# Altium schematic sheet NANO_HEADER.SchDoc
size A; SheetNumber: 10; SheetTotal: 14
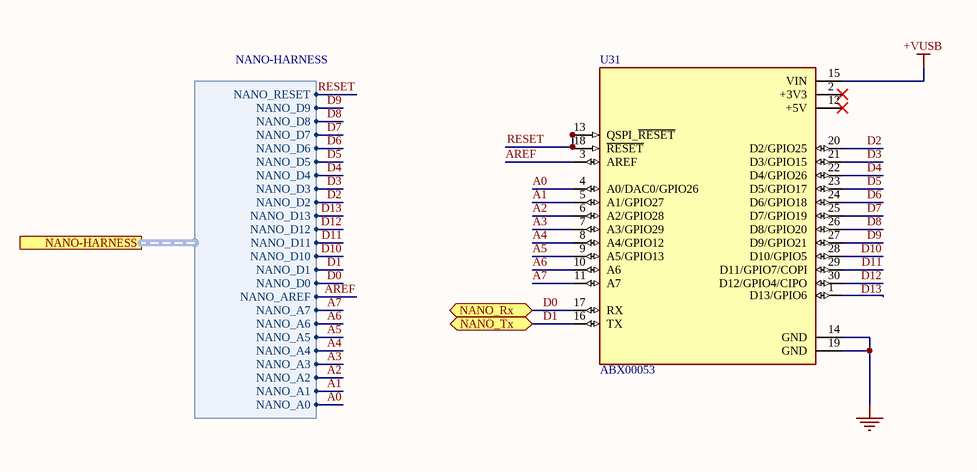
[diagram p0: NANO_HEADER.SchDoc]

## Parts
U31  ABX00053  [MODULE_ABX00053]

## Ports
NANO-HARNESS (harness NANO-HARNESS), NANO_Rx (bidir), NANO_Tx (bidir)

## Harnesses
NANO-HARNESS: NANO_A0, NANO_A1, NANO_A2, NANO_A3, NANO_A4, NANO_A5, NANO_A6, NANO_A7, NANO_AREF, NANO_D0, NANO_D1, NANO_D10, NANO_D11, NANO_D12, NANO_D13, NANO_D2, NANO_D3, NANO_D4, NANO_D5, NANO_D6, NANO_D7, NANO_D8, NANO_D9, NANO_RESET

## Nets
+VUSB: U31.15(VIN)
GND: U31.14(GND) U31.19(GND)
A0: U31.4(A0/DAC0/GPIO26) ; port NANO-HARNESS.NANO_A0
A1: U31.5(A1/GPIO27) ; port NANO-HARNESS.NANO_A1
A2: U31.6(A2/GPIO28) ; port NANO-HARNESS.NANO_A2
A3: U31.7(A3/GPIO29) ; port NANO-HARNESS.NANO_A3
A4: U31.8(A4/GPIO12) ; port NANO-HARNESS.NANO_A4
A5: U31.9(A5/GPIO13) ; port NANO-HARNESS.NANO_A5
A6: U31.10(A6) ; port NANO-HARNESS.NANO_A6
A7: U31.11(A7) ; port NANO-HARNESS.NANO_A7
AREF: U31.3(AREF) ; port NANO-HARNESS.NANO_AREF
D0: U31.17(RX) ; port NANO_Rx, port NANO-HARNESS.NANO_D0
D1: U31.16(TX) ; port NANO_Tx, port NANO-HARNESS.NANO_D1
D2: U31.20(D2/GPIO25) ; port NANO-HARNESS.NANO_D2
D3: U31.21(D3/GPIO15) ; port NANO-HARNESS.NANO_D3
D4: U31.22(D4/GPIO26) ; port NANO-HARNESS.NANO_D4
D5: U31.23(D5/GPIO17) ; port NANO-HARNESS.NANO_D5
D6: U31.24(D6/GPIO18) ; port NANO-HARNESS.NANO_D6
D7: U31.25(D7/GPIO19) ; port NANO-HARNESS.NANO_D7
D8: U31.26(D8/GPIO20) ; port NANO-HARNESS.NANO_D8
D9: U31.27(D9/GPIO21) ; port NANO-HARNESS.NANO_D9
D10: U31.28(D10/GPIO5) ; port NANO-HARNESS.NANO_D10
D11: U31.29(D11/GPIO7/COPI) ; port NANO-HARNESS.NANO_D11
D12: U31.30(D12/GPIO4/CIPO) ; port NANO-HARNESS.NANO_D12
D13: U31.1(D13/GPIO6) ; port NANO-HARNESS.NANO_D13
RESET: U31.13(QSPI_~{RESET}) U31.18(~{RESET}) ; port NANO-HARNESS.NANO_RESET

Not connected (* = marked no-connect by the designer): U31 2(+3V3)* 12(+5V)*

## Library data of the parts
U31 = ABX00053: NINA-W102, RP2040 Arduino Nano RP2040 Connect with Headers series ARMÂ® CortexÂ®-M0+ MCU 32-Bit Embedded Evaluation Board; Value: *; SnapEDA_Link: https://www.snapeda.com/parts/ABX00053/Arduino/view-part/?ref=snap; MF: Arduino; Purchase-URL: https://pricing.snapeda.com/search/part/ABX00053/?ref=eda; Check_prices: https://www.snapeda.com/parts/ABX00053/Arduino/view-part/?ref=eda; Digi-Key_Part_Number: 1050-ABX00053-ND; Package: None; MP: ABX00053